# EasyEDA schematic SCH_Color_Sensor_OPS_2021-07-07.json
TITLE: Sheet_1; REV: 1.0; Date: 2021-07-07; Sheet: 1/1; Drawn By: M Aitesam; Company: aitesam961
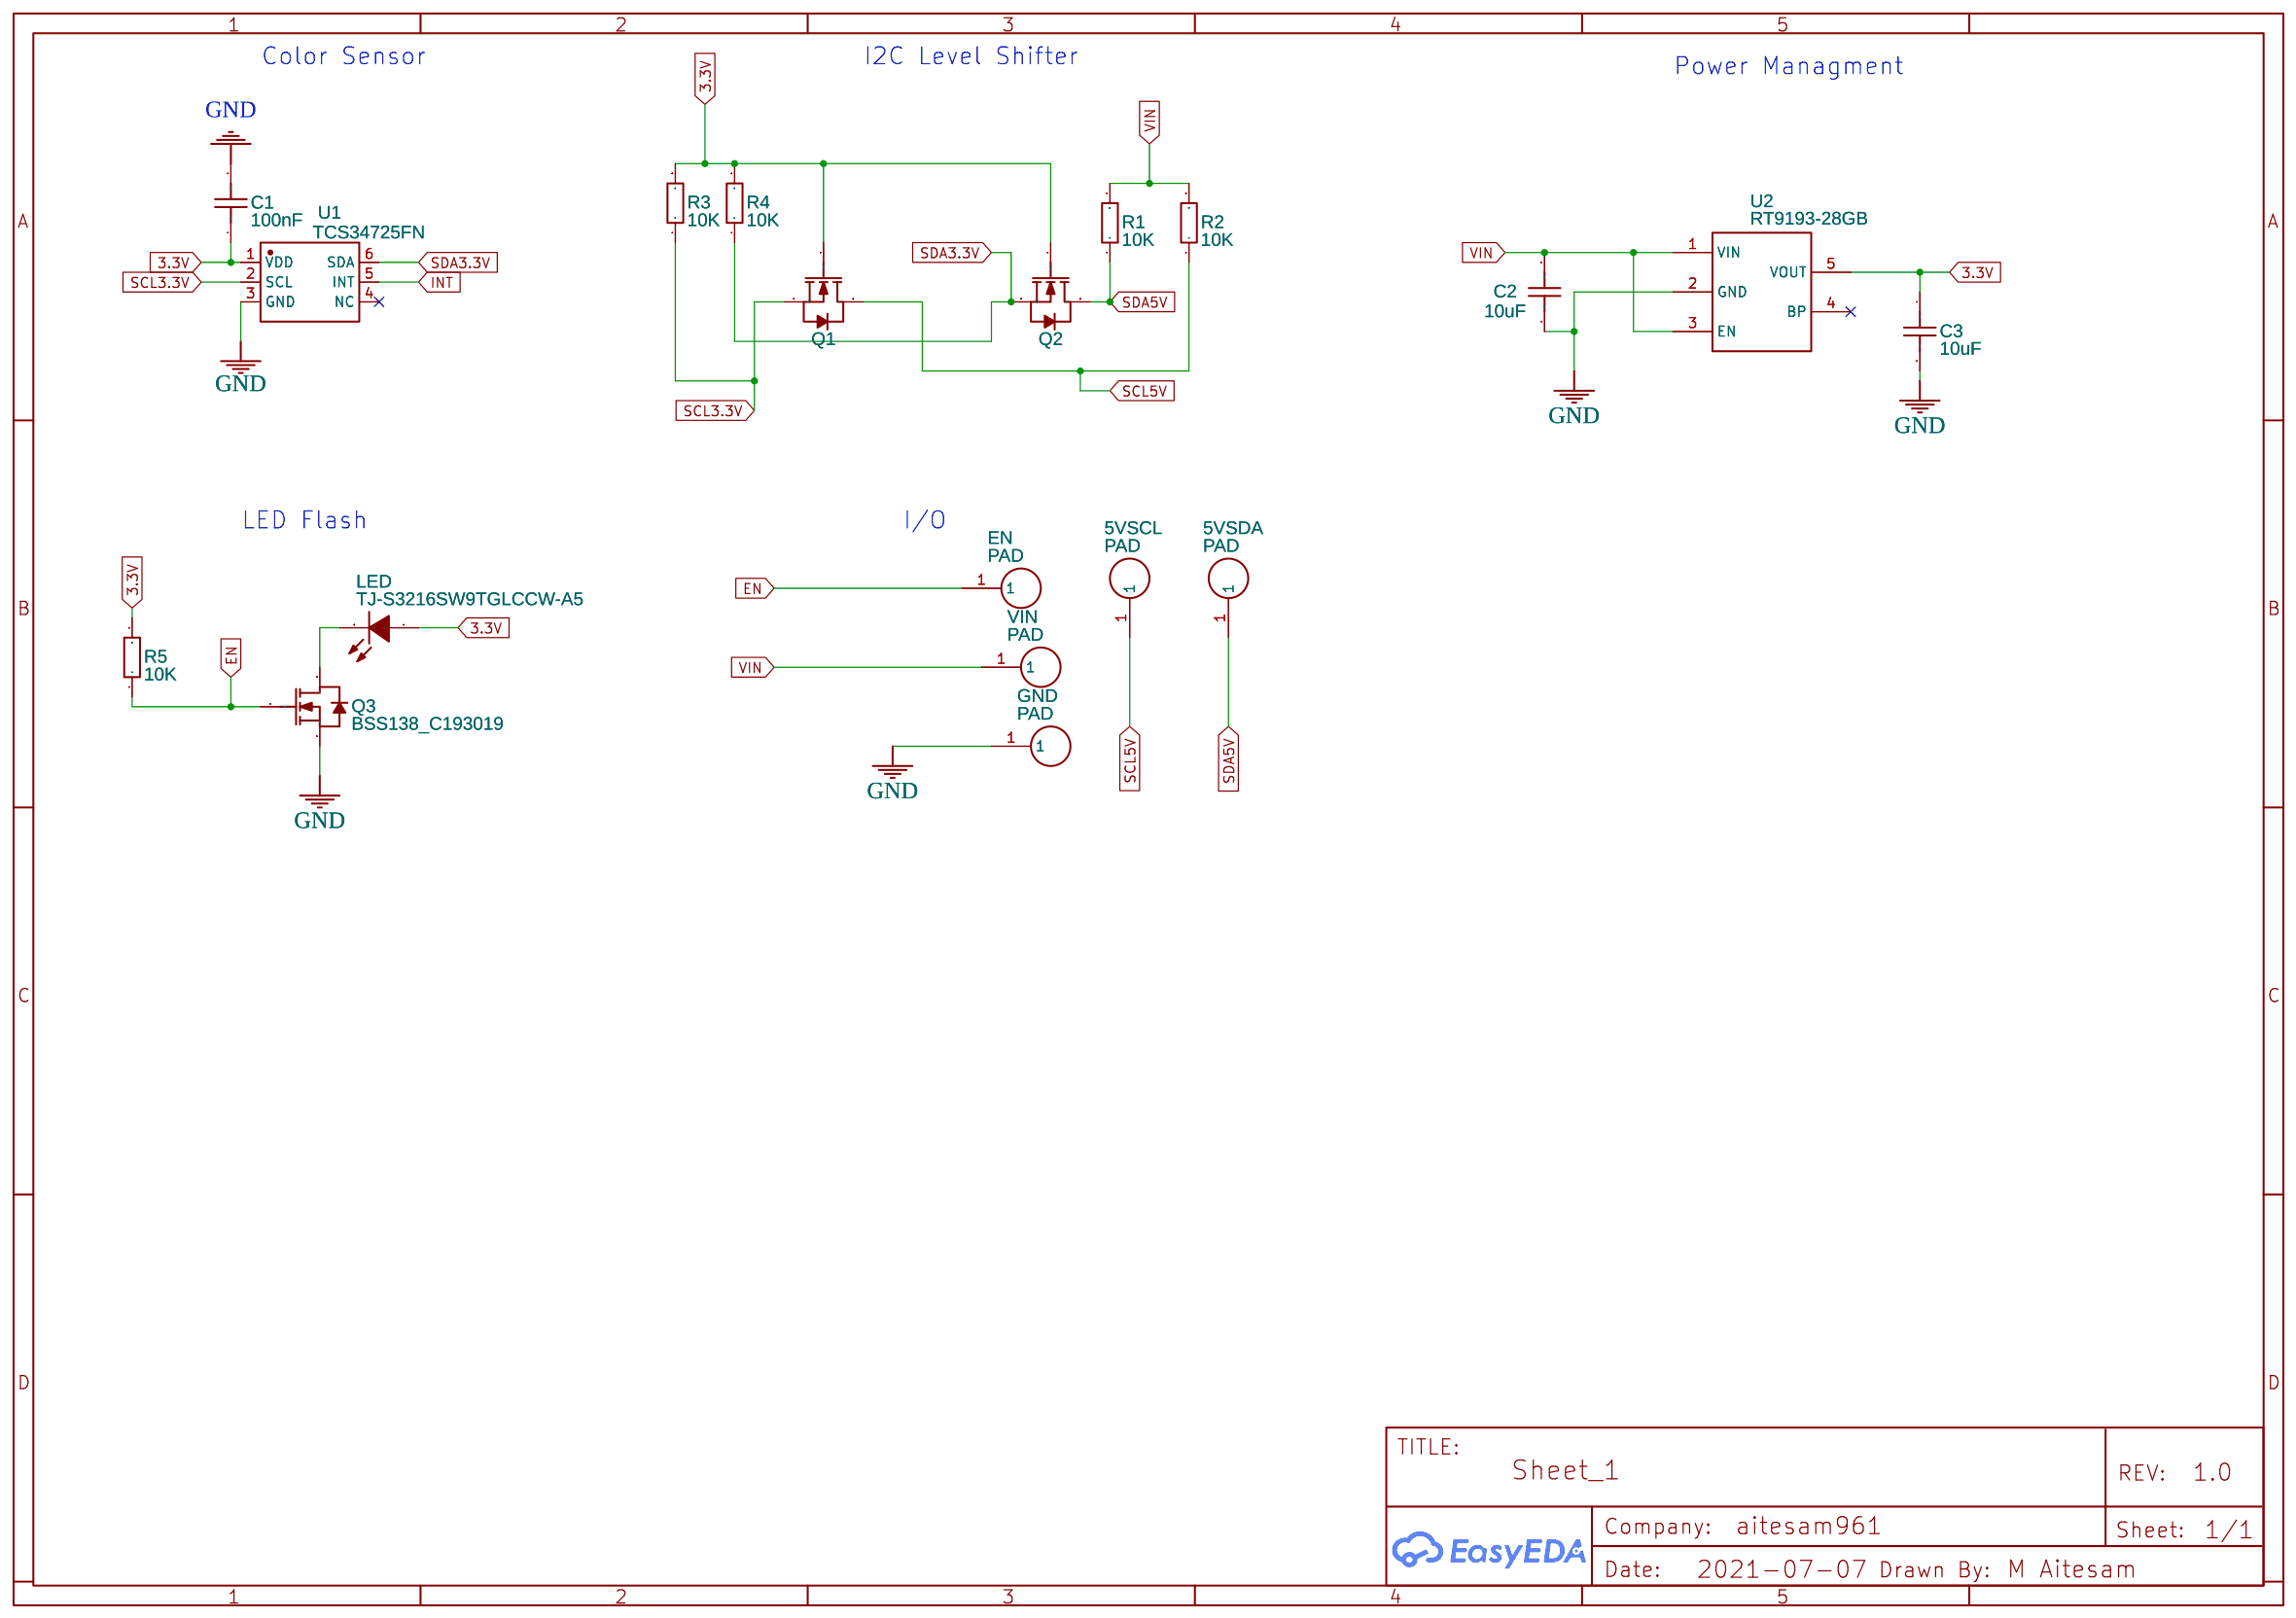
[diagram p0: schematic sheet]

## Parts
5VSCL  PAD  [PAD]
5VSDA  PAD  [PAD]
C1  100nF  [C0402]
C2  10uF  [C0603]
C3  10uF  [C0603]
EN  PAD  [PAD]
GND  PAD  [PAD]
LED  TJ-S3216SW9TGLCCW-A5  [LED1206-R-RD]
Q1  BSS138_C193019  [SOT-23-3_L3.0-W1.7-P0.95-LS2.9-BR]
Q2  BSS138_C193019  [SOT-23-3_L3.0-W1.7-P0.95-LS2.9-BR]
Q3  BSS138_C193019  [SOT-23-3_L3.0-W1.7-P0.95-LS2.9-BR]
R1  10K  [R0603]
R2  10K  [R0603]
R3  10K  [R0603]
R4  10K  [R0603]
R5  10K  [R0603]
U1  TCS34725FN  [SENSOR-SMD_TCS34725FN]
U2  RT9193-28GB  [SOT-23-5_L3.0-W1.7-P0.95-LS2.8-BR]
VIN  PAD  [PAD]

## Library data of the parts
5VSCL 5VSDA EN GND VIN = PAD: Contributor: Heubeul
C1 = GCM155R71C104KA55D: Supplier: LCSC; Manufacturer: MuRata; Supplier Part: C85857
C2 C3 = CL10A106MQ8NNNC: Supplier: LCSC; Manufacturer: SAMSUNG; Supplier Part: C1691; JLCPCB Part Class: Extended Part
LED = TJ-S3216SW9TGLCCW-A5: Supplier: LCSC; Supplier Part: C192680; Manufacturer: TOGIALED; Contributor: LCSC; JLCPCB Part Class: Extended Part
Q1-Q3 = BSS138_C193019: Supplier: LCSC; Supplier Part: C193019; Manufacturer: AnBon; Manufacturer Part: BSS138; Contributor: LCSC; JLCPCB Part Class: Extended Part
R1-R5 = 0603WAJ0103T5E: Supplier: LCSC; Manufacturer: UniOhm; Supplier Part: C15401; JLCPCB Part Class: Extended Part
U1 = TCS34725FN: Supplier: LCSC; Supplier Part: C2649487; Manufacturer: 美国AMS; JLCPCB Part Class: Extended Part; Contributor: LCSC
U2 = RT9193-28GB: Supplier: LCSC; Manufacturer: RICHTEK; Supplier Part: C56731; JLCPCB Part Class: Extended Part

## Nets
3.3V: C1.1 C3.1 LED.1(A) Q1.1(G) Q2.1(G) R3.2 R4.2 R5.2 U1.1(VDD) U2.5(VOUT)
GND: C1.2 C2.1 C3.2 GND.1 Q3.2(S) U1.3(GND) U2.2(GND)
VIN: C2.2 R1.2 R2.2 U2.1(VIN) U2.3(EN) VIN.1
EN: EN.1 Q3.1(G) R5.1
INT: U1.5(INT)
SCL3.3V: Q1.2(S) R3.1 U1.2(SCL)
SCL5V: 5VSCL.1 Q1.3(D) R2.1
SDA3.3V: Q2.2(S) R4.1 U1.6(SDA)
SDA5V: 5VSDA.1 Q2.3(D) R1.1
Net-(LED-2): LED.2(K) Q3.3(D)

Not connected (* = marked no-connect by the designer): U1 4(NC)*; U2 4(BP)*

## Notes on the sheet
- Color Sensor
- I2C Level Shifter
- Power Managment
- LED Flash
- I/O
